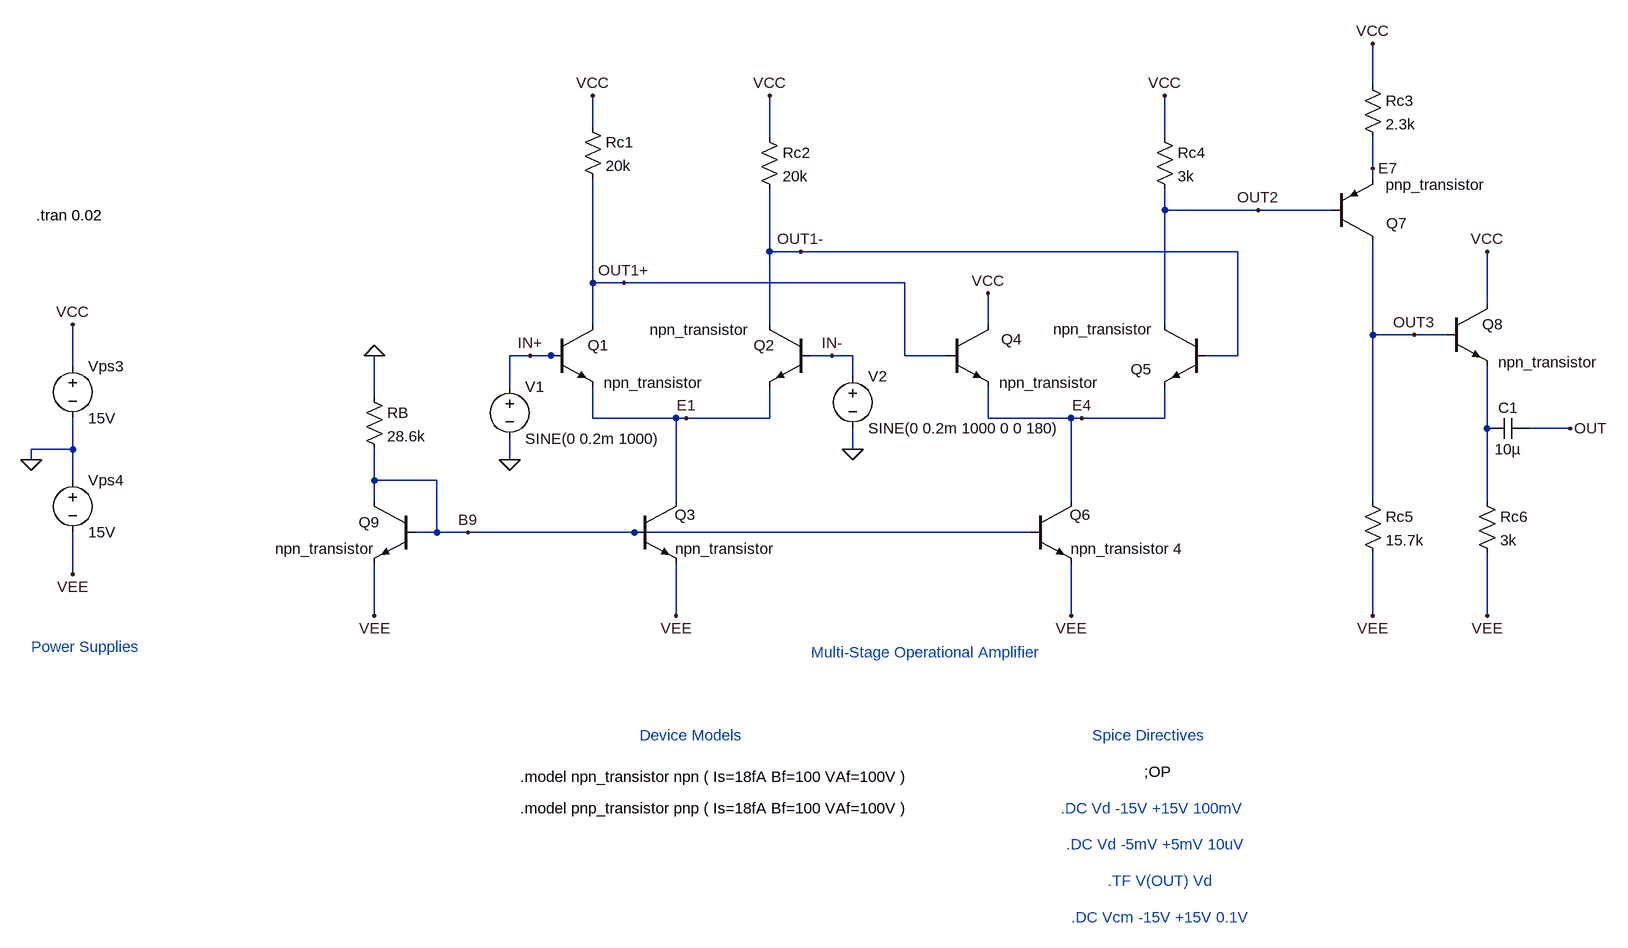
[diagram p0: schematic multistage_amplifier_a.asc]
multistage_amplifier_a.asc, the LTspice schematic file:
Version 4
SHEET 1 2876 1032
WIRE 2480 -368 2480 -432
WIRE 1280 -304 1280 -352
WIRE 1552 -288 1552 -352
WIRE 2160 -288 2160 -352
WIRE 2480 -240 2480 -288
WIRE 2480 -224 2480 -240
WIRE 2160 -176 2160 -208
WIRE 2304 -176 2160 -176
WIRE 2416 -176 2304 -176
WIRE 1552 -112 1552 -208
WIRE 1600 -112 1552 -112
WIRE 2272 -112 1600 -112
WIRE 1280 -64 1280 -224
WIRE 1328 -64 1280 -64
WIRE 1760 -64 1328 -64
WIRE 2656 -32 2656 -112
WIRE 1280 0 1280 -64
WIRE 1552 0 1552 -112
WIRE 1888 0 1888 -48
WIRE 2160 0 2160 -176
WIRE 2480 16 2480 -128
WIRE 2544 16 2480 16
WIRE 2592 16 2544 16
WIRE 1184 48 1152 48
WIRE 1216 48 1184 48
WIRE 1232 48 1216 48
WIRE 1648 48 1616 48
WIRE 1680 48 1648 48
WIRE 1760 48 1760 -64
WIRE 1824 48 1760 48
WIRE 2272 48 2272 -112
WIRE 2272 48 2224 48
WIRE 480 64 480 0
WIRE 1680 80 1680 48
WIRE 1152 96 1152 48
WIRE 944 112 944 48
WIRE 1280 144 1280 96
WIRE 1408 144 1280 144
WIRE 1424 144 1408 144
WIRE 1552 144 1552 96
WIRE 1552 144 1424 144
WIRE 1888 144 1888 96
WIRE 2016 144 1888 144
WIRE 2032 144 2016 144
WIRE 2160 144 2160 96
WIRE 2160 144 2032 144
WIRE 2656 160 2656 64
WIRE 2784 160 2720 160
WIRE 480 192 480 144
WIRE 480 192 416 192
WIRE 1680 192 1680 160
WIRE 416 208 416 192
WIRE 1152 208 1152 176
WIRE 480 240 480 192
WIRE 944 240 944 192
WIRE 1040 240 944 240
WIRE 944 272 944 240
WIRE 1408 272 1408 144
WIRE 2016 272 2016 144
WIRE 2480 272 2480 16
WIRE 2656 272 2656 160
WIRE 1040 320 1040 240
WIRE 1040 320 1008 320
WIRE 1088 320 1040 320
WIRE 1344 320 1088 320
WIRE 1952 320 1344 320
WIRE 480 384 480 320
WIRE 944 448 944 368
WIRE 1408 448 1408 368
WIRE 2016 448 2016 368
WIRE 2480 448 2480 352
WIRE 2656 448 2656 352
FLAG 1280 -352 VCC
FLAG 1424 144 E1
FLAG 1552 -352 VCC
FLAG 1184 48 IN+
FLAG 1648 48 IN-
FLAG 1328 -64 OUT1+
FLAG 1600 -112 OUT1-
FLAG 416 208 0
FLAG 480 0 VCC
FLAG 480 384 VEE
FLAG 1888 -48 VCC
FLAG 2032 144 E4
FLAG 2160 -352 VCC
FLAG 2304 -176 OUT2
FLAG 2480 -432 VCC
FLAG 2656 -112 VCC
FLAG 2784 160 OUT
FLAG 2544 16 OUT3
FLAG 944 448 VEE
FLAG 1408 448 VEE
FLAG 2480 448 VEE
FLAG 2656 448 VEE
FLAG 944 48 0
FLAG 2480 -240 E7
FLAG 1088 320 B9
FLAG 2016 448 VEE
FLAG 1152 208 0
FLAG 1680 192 0
SYMBOL npn 1216 0 R0
WINDOW 3 81 90 Left 2
SYMATTR Value npn_transistor
SYMATTR InstName Q1
SYMBOL npn 1616 0 M0
WINDOW 3 95 8 Left 2
SYMATTR Value npn_transistor
SYMATTR InstName Q2
SYMBOL res 1264 -320 R0
SYMATTR InstName Rc1
SYMATTR Value 20k
SYMBOL res 1536 -304 R0
SYMATTR InstName Rc2
SYMATTR Value 20k
SYMBOL voltage 480 48 R0
SYMATTR InstName Vps3
SYMATTR Value 15V
SYMBOL voltage 480 224 R0
SYMATTR InstName Vps4
SYMATTR Value 15V
SYMBOL npn 1344 272 R0
WINDOW 3 63 73 Left 2
WINDOW 0 62 21 Left 2
SYMATTR Value npn_transistor
SYMATTR InstName Q3
SYMBOL npn 1008 272 M0
WINDOW 3 63 73 Left 2
SYMATTR Value npn_transistor
SYMATTR InstName Q9
SYMBOL res 928 96 R0
SYMATTR InstName RB
SYMATTR Value 28.6k
SYMBOL npn 1824 0 R0
WINDOW 3 81 90 Left 2
WINDOW 0 84 23 Left 2
SYMATTR Value npn_transistor
SYMATTR InstName Q4
SYMBOL npn 2224 0 M0
WINDOW 3 82 7 Left 2
WINDOW 0 84 69 Left 2
SYMATTR Value npn_transistor
SYMATTR InstName Q5
SYMBOL res 2144 -304 R0
SYMATTR InstName Rc4
SYMATTR Value 3k
SYMBOL npn 2592 -32 R0
WINDOW 3 81 90 Left 2
SYMATTR Value npn_transistor
SYMATTR InstName Q8
SYMBOL pnp 2416 -128 M180
WINDOW 0 85 28 Left 2
WINDOW 3 84 87 Left 2
SYMATTR InstName Q7
SYMATTR Value pnp_transistor
SYMBOL res 2464 -384 R0
SYMATTR InstName Rc3
SYMATTR Value 2.3k
SYMBOL res 2464 256 R0
SYMATTR InstName Rc5
SYMATTR Value 15.7k
SYMBOL res 2640 256 R0
SYMATTR InstName Rc6
SYMATTR Value 3k
SYMBOL npn 1952 272 R0
WINDOW 3 63 73 Left 2
WINDOW 0 62 21 Left 2
SYMATTR Value npn_transistor 4
SYMATTR InstName Q6
SYMBOL voltage 1152 80 R0
WINDOW 123 0 0 Left 0
WINDOW 39 0 0 Left 0
SYMATTR InstName V1
SYMATTR Value SINE(0 0.2m 1000)
SYMBOL voltage 1680 64 R0
WINDOW 123 0 0 Left 0
WINDOW 39 0 0 Left 0
SYMATTR InstName V2
SYMATTR Value SINE(0 0.2m 1000 0 0 180)
SYMBOL cap 2720 144 R90
WINDOW 0 0 32 VBottom 2
WINDOW 3 32 32 VTop 2
SYMATTR InstName C1
SYMATTR Value 10µ
TEXT 1168 696 Left 2 !.model npn_transistor npn ( Is=18fA Bf=100 VAf=100V )
TEXT 2128 688 Left 2 !;OP
TEXT 416 496 Left 2 ;Power Supplies
TEXT 1616 504 Left 2 ;Multi-Stage Operational Amplifier
TEXT 1352 632 Left 2 ;Device Models
TEXT 2048 632 Left 2 ;Spice Directives
TEXT 1168 744 Left 2 !.model pnp_transistor pnp ( Is=18fA Bf=100 VAf=100V )
TEXT 2000 744 Left 2 ;.DC Vd -15V +15V 100mV
TEXT 2008 800 Left 2 ;.DC Vd -5mV +5mV 10uV
TEXT 2072 856 Left 2 ;.TF V(OUT) Vd
TEXT 2016 912 Left 2 ;.DC Vcm -15V +15V 0.1V
TEXT 424 -168 Left 2 !.tran 0.02

The netlist it stands for:
* multistage_amplifier_a.asc
Q1 OUT1+ IN+ E1 0 npn_transistor
Q2 OUT1- IN- E1 0 npn_transistor
Rc1 VCC OUT1+ 20k
Rc2 VCC OUT1- 20k
Vps3 VCC 0 15V
Vps4 0 VEE 15V
Q3 E1 B9 VEE 0 npn_transistor
Q9 B9 B9 VEE 0 npn_transistor
RB 0 B9 28.6k
Q4 VCC OUT1+ E4 0 npn_transistor
Q5 OUT2 OUT1- E4 0 npn_transistor
Rc4 VCC OUT2 3k
Q8 VCC OUT3 N001 0 npn_transistor
Q7 OUT3 OUT2 E7 0 pnp_transistor
Rc3 VCC E7 2.3k
Rc5 OUT3 VEE 15.7k
Rc6 N001 VEE 3k
Q6 E4 B9 VEE 0 npn_transistor 4
V1 IN+ 0 SINE(0 0.2m 1000)
V2 IN- 0 SINE(0 0.2m 1000 0 0 180)
C1 OUT N001 10µ
.model NPN NPN
.model PNP PNP
.lib standard.bjt
.model npn_transistor npn ( Is=18fA Bf=100 VAf=100V )
;OP
* Power Supplies
* Multi-Stage Operational Amplifier
* Device Models
* Spice Directives
.model pnp_transistor pnp ( Is=18fA Bf=100 VAf=100V )
* .DC Vd -15V +15V 100mV
* .DC Vd -5mV +5mV 10uV
* .TF V(OUT) Vd
* .DC Vcm -15V +15V 0.1V
.tran 0.02
.backanno
.end